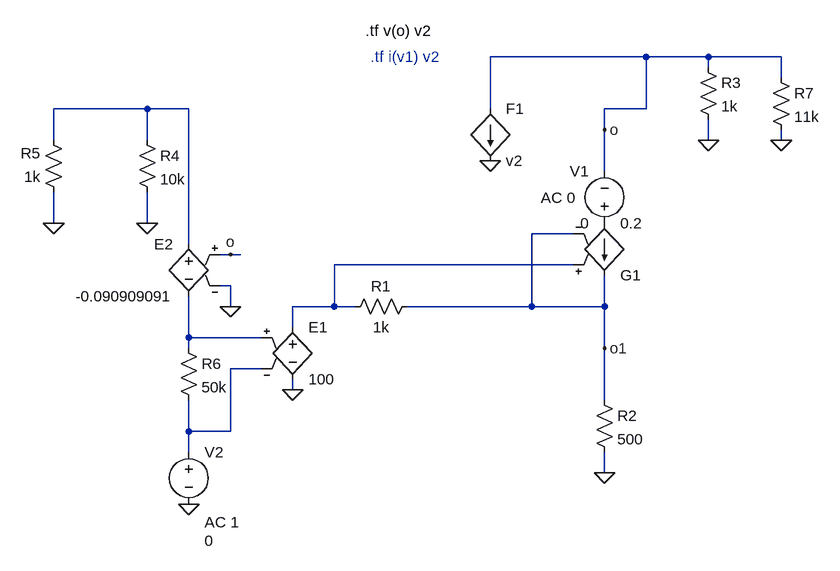
[diagram p0: schematic pruebametodo6.asc]
pruebametodo6.asc, the LTspice schematic file:
Version 4
SHEET 1 1112 1092
WIRE 784 -288 544 -288
WIRE 880 -288 784 -288
WIRE 992 -288 880 -288
WIRE 880 -272 880 -288
WIRE 992 -256 992 -288
WIRE 16 -208 -128 -208
WIRE 80 -208 16 -208
WIRE 544 -208 544 -288
WIRE 784 -208 784 -288
WIRE 784 -208 720 -208
WIRE 720 -176 720 -208
WIRE -128 -160 -128 -208
WIRE 16 -160 16 -208
WIRE 880 -160 880 -192
WIRE 992 -160 992 -176
WIRE 720 -112 720 -176
WIRE -128 -32 -128 -80
WIRE 16 -32 16 -80
WIRE 672 -16 608 -16
WIRE 80 0 80 -208
WIRE 144 16 128 16
WIRE 160 16 144 16
WIRE 672 32 304 32
WIRE 144 64 128 64
WIRE 144 96 144 64
WIRE 304 96 304 32
WIRE 304 96 240 96
WIRE 336 96 304 96
WIRE 608 96 608 -16
WIRE 608 96 416 96
WIRE 720 96 720 48
WIRE 720 96 608 96
WIRE 240 128 240 96
WIRE 80 144 80 80
WIRE 192 144 80 144
WIRE 80 160 80 144
WIRE 720 160 720 96
WIRE 192 192 144 192
WIRE 240 224 240 208
WIRE 720 240 720 160
WIRE 80 288 80 240
WIRE 144 288 144 192
WIRE 144 288 80 288
WIRE 80 320 80 288
WIRE 720 352 720 320
FLAG 720 352 0
FLAG 880 -160 0
FLAG 720 160 o1
FLAG -128 -32 0
FLAG 720 -176 o
FLAG 80 400 0
FLAG 240 224 0
FLAG 16 -32 0
FLAG 144 96 0
FLAG 144 16 o
FLAG 992 -160 0
FLAG 544 -128 0
SYMBOL e 240 112 R0
SYMATTR InstName E1
SYMATTR Value 100
SYMBOL res 320 112 R270
WINDOW 0 32 56 VTop 2
WINDOW 3 0 56 VBottom 2
SYMATTR InstName R1
SYMATTR Value 1k
SYMBOL g 720 64 M180
SYMATTR InstName G1
SYMATTR Value 0.2
SYMBOL res 704 224 R0
SYMATTR InstName R2
SYMATTR Value 500
SYMBOL res 864 -288 R0
SYMATTR InstName R3
SYMATTR Value 1k
SYMBOL res -112 -64 R180
WINDOW 0 36 76 Left 2
WINDOW 3 36 40 Left 2
SYMATTR InstName R5
SYMATTR Value 1k
SYMBOL res 64 144 R0
SYMATTR InstName R6
SYMATTR Value 50k
SYMBOL voltage 720 -16 R180
WINDOW 0 24 96 Left 2
WINDOW 3 24 16 Left 2
WINDOW 123 45 55 Left 2
WINDOW 39 0 0 Left 0
SYMATTR InstName V1
SYMATTR Value 0
SYMATTR Value2 AC 0
SYMBOL voltage 80 304 R0
WINDOW 3 24 152 Left 2
WINDOW 123 24 124 Left 2
WINDOW 39 0 0 Left 0
SYMATTR Value 0
SYMATTR Value2 AC 1
SYMATTR InstName V2
SYMBOL res 0 -176 R0
SYMATTR InstName R4
SYMATTR Value 10k
SYMBOL e 80 -16 M0
SYMATTR InstName E2
SYMATTR Value -0.090909091
SYMBOL res 976 -272 R0
SYMATTR InstName R7
SYMATTR Value 11k
SYMBOL f 544 -208 R0
SYMATTR InstName F1
SYMATTR Value v2
SYMATTR Value2 0.090909091
TEXT 352 -328 Left 2 !.tf v(o) v2
TEXT 360 -288 Left 2 ;.tf i(v1) v2

The netlist it stands for:
* pruebametodo6.asc
E1 N002 0 N003 N004 100
R1 N002 o1 1k
G1 P001 o1 N002 o1 0.2
R2 o1 0 500
R3 o 0 1k
R5 0 N001 1k
R6 N003 N004 50k
V1 P001 o 0 AC 0
V2 N004 0 0 AC 1
R4 N001 0 10k
E2 N001 N003 o 0 -0.090909091
R7 o 0 11k
F1 o 0 v2 0.090909091
.tf v(o) v2
* .tf i(v1) v2
.backanno
.end